# EAGLE design Relais2-N_Channel_MOSFET-V001 (EAGLE 9.5.1)
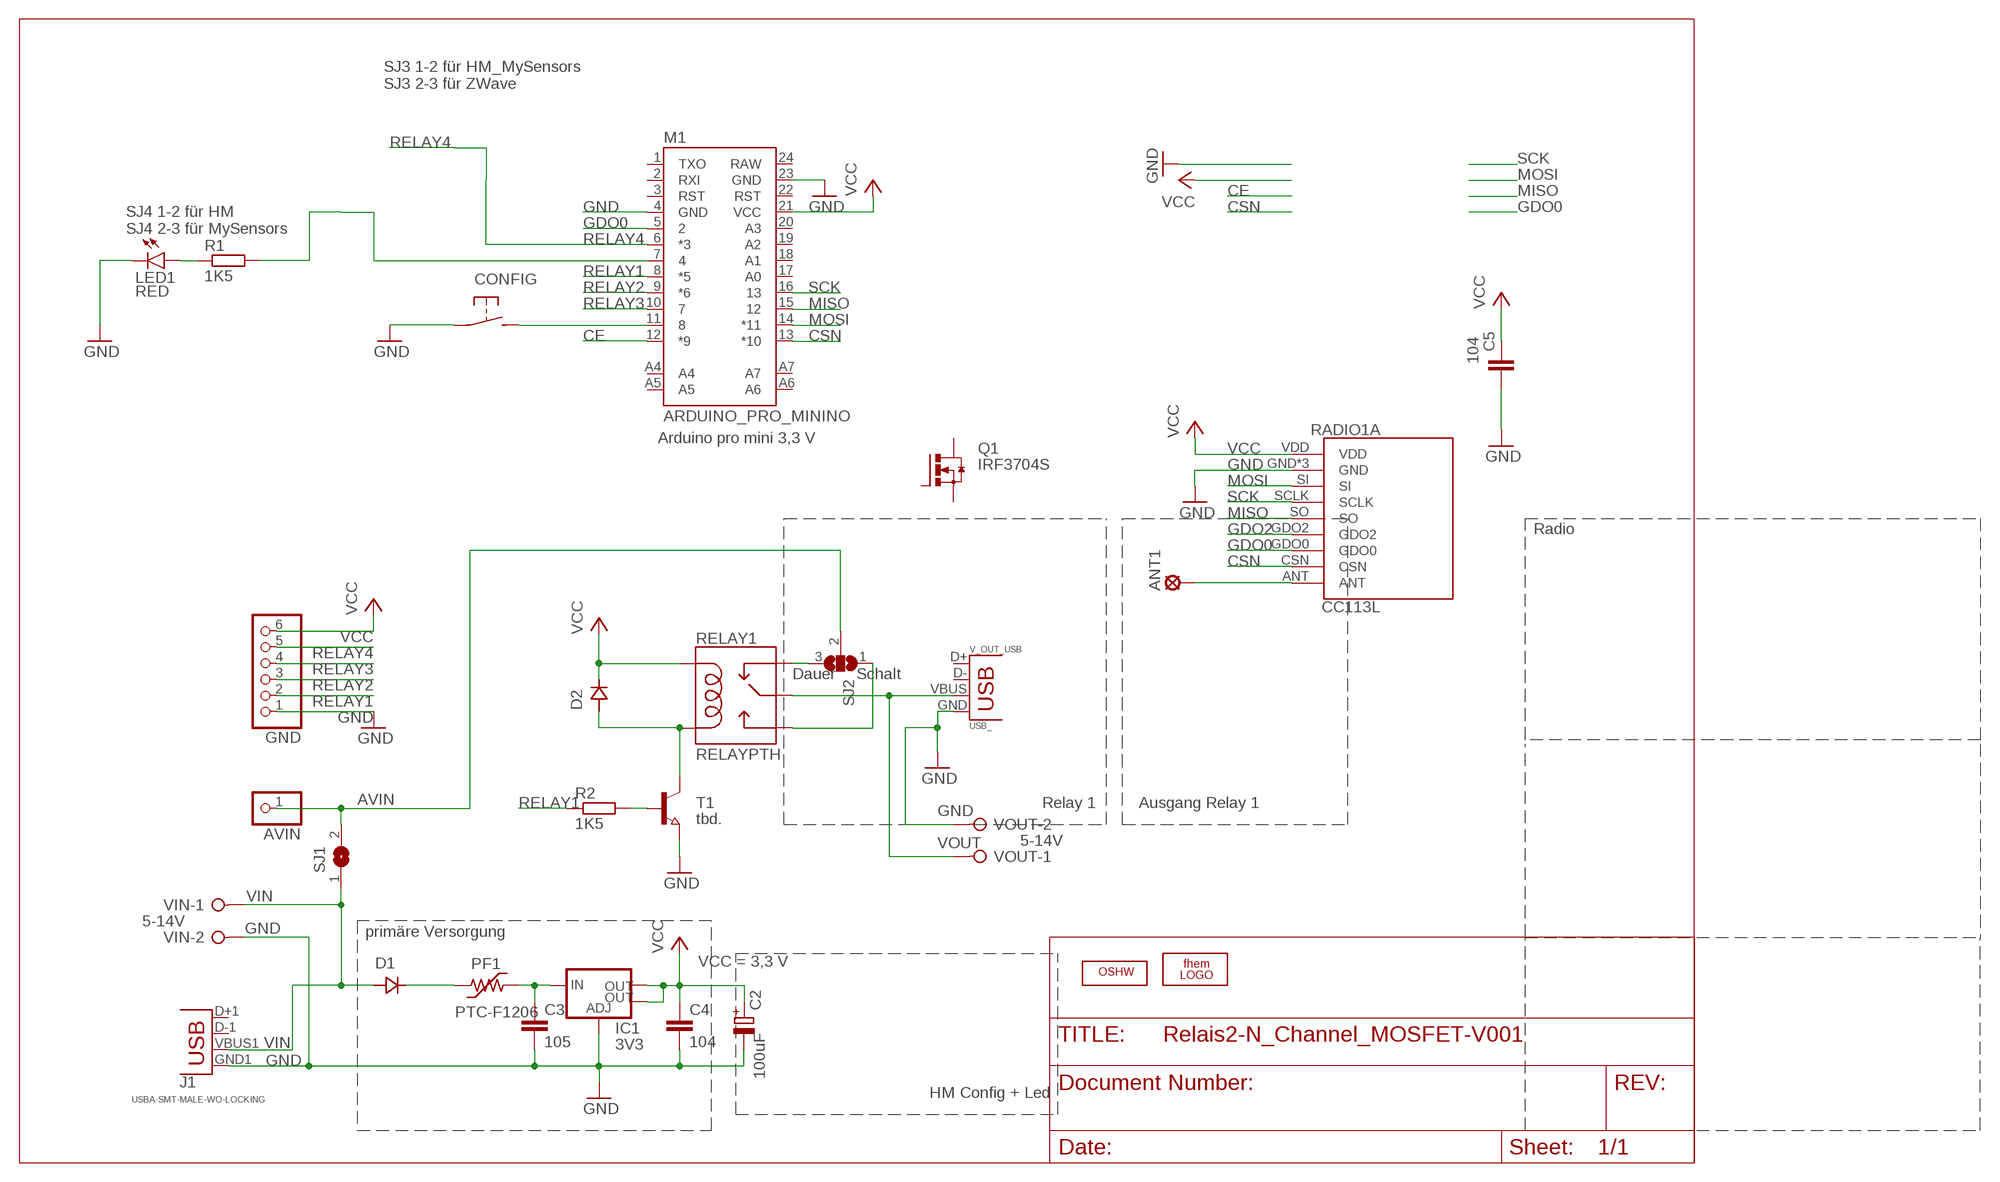
[diagram p0: schematic, sheet 1]

## Parts
ANT1  LSP10  [LSP10]
AVIN  PINHD-1X1  [1X01]
C2  100uF  CPOL-EUE2,5-6E  [E2,5-6E]
C3  105  C-EUC0805  [C0805]
C4  104  C-EUC0805  [C0805]
C5  104  C-EUC0805  [C0805]
CONFIG  TASTERSMD  [TASTER-SMD]
D1  SS14  [DO214]
D2  SS14  [DO214]
GND  PINHD-1X6_S  [1X06]
IC1  3V3  V_REG_LM1117SOT223  [SOT223]
J1  USBA-SMT-MALE-WO-LOCKING  [USB-A-SMT-MALE-NO_LOCKING]
LED1  RED  LED-RED1206  [LED-1206]
LOGO2  LOGO_OSHWX0070  [OSHW_6X70]
M1  ARDUINO_PRO_MININO  [ARDUINO_PRO_MINI_O]
PF1  PTC-F1206  [F1206]
Q1  IRF3704S  [D2PACK]
R1  1K5  R0805_SMALL_GAP  [R0805_SMALL_GAP]
R2  1K5  R0805_SMALL_GAP  [R0805_SMALL_GAP]
RADIO1A  CC113L  [CC113L]
RELAY1  RELAYPTH  [SRD-05VDC-SL-C]
SJ1  SJ  [SJ]
SJ2  SJ2W  [SJ_2]
T1  tbd.  NPN-TRANSISTOR_SOT89  [SOT89]
U$2  LOGO_FHEMSTOP  [LOGO_FHEM_3X3_STOP]
V_OUT_USB  USB_  [USB-A-S-SILK-FEMALE]
VIN  W237-02P  [W237-132]
VOUT  W237-02P  [W237-132]

## Nets
AVIN: AVIN.1 SJ1.2 SJ2.2
CE: M1.12(*9)
CSN: M1.13(*10) RADIO1A.CSN
DAUER: RELAY1.SWCLOSED(SWCLOSE) SJ2.3
GDO0: M1.5 RADIO1A.GDO0
GDO2: RADIO1A.GDO2
GND: C2.- C3.2 C4.2 C5.2 CONFIG.1(P) GND.1 IC1.1(ADJ) J1.GND1(GND) LED1.C M1.4(GND) M1.23(GND) RADIO1A.GND RADIO1A.GND1(GND) RADIO1A.GND2(GND) T1.3(E) V_OUT_USB.GND VIN.2 VOUT.2
LED: M1.7 R1.2
MISO: M1.15 RADIO1A.SO
MOSI: M1.14(*11) RADIO1A.SI
N$1: CONFIG.2(S) M1.11
N$3: LED1.A R1.1
N$11: ANT1.1(MP) RADIO1A.ANT
N$13: D2.ANODE RELAY1.COIL0 T1.2(C)
N$16: R2.2 T1.1(B)
RELAY1: GND.2 M1.8(*5) R2.1
RELAY2: GND.3 M1.9(*6)
RELAY3: GND.4 M1.10
RELAY4: GND.5 M1.6(*3)
SCHALT: RELAY1.SWOPEN SJ2.1
SCK: M1.16 RADIO1A.SCLK
VCC: C2.+ C4.1 C5.1 D2.CATHODE GND.6 IC1.2(OUT) IC1.4(OUT) M1.21(VCC) RADIO1A.VDD RELAY1.COIL1
VIN: D1.ANODE J1.VBUS1(VBUS) SJ1.1 VIN.1
VOUT: RELAY1.SWCOMMON V_OUT_USB.VBUS VOUT.1
VREG_IN: C3.1 IC1.3(IN) PF1.2
VUSB: D1.CATHODE PF1.1
Unconnected: J1.D+1(D+) J1.D-1(D-) M1.1(TXO) M1.2(RXI) M1.3(RST) M1.17(A0) M1.18(A1) M1.19(A2) M1.20(A3) M1.22(RST) M1.24(RAW) M1.A4 M1.A5 M1.A6 M1.A7 Q1.1(G) Q1.2(D) Q1.3(S) V_OUT_USB.D+ V_OUT_USB.D-

## Notes on the sheet
- SJ3 1-2 für HM_MySensors
  SJ3 2-3 für ZWave
- SJ4 1-2 für HM
  SJ4 2-3 für MySensors
- Arduino pro mini 3,3 V
- Radio
- Dauer | Schalt
- Relay 1 | Ausgang Relay 1
- 5-14V
- 5-14V
- primäre Versorgung
- VCC = 3,3 V
- HM Config + Led

## Library data of the parts
ANT1 = Hexenmeister:LSP10: SOLDER PAD drill 1.0 mm, distributor Buerklin, 12H555
AVIN = pinhead:PINHD-1X1: PIN HEADER
C2 = rcl:CPOL-EU: POLARIZED CAPACITOR, European symbol
C3-C5 = resistor:C-EU: CAPACITOR, European symbol
CONFIG = Damian:TASTER: Microtaster
D1 D2 = ihpcb-diode:SS14
GND = Hexenmeister:PINHD-1X6_S: PIN HEADER
IC1 = SparkFun-PowerIC:V_REG_LM1117: Voltage Regulator LM1117 Standard adjustable voltage regulator but in SMD form. Spark Fun Electronics SKU : COM-00595; PROD_ID: VREG-08170
J1 V_OUT_USB = SparkFun-Connectors:USB: USB Connectors USB-B-PTH is fully proven SKU : PRT-00139/CONN-08278 USB-miniB is fully proven SKU : PRT-00587 USB-A-PCB is untested. USB-A-H is throughly reviewed, but untested. Spark Fun Electronics SKU : PRT-00437 USB-B-SMT is throughly reviewed, but untested. Needs silkscreen touching up. USB-A-S has not been used/tested USB-MB-H has not been used/tested USB-MICROB has been used. CONN-09505
LED1 = SparkFun-LED:LED-RED: Assorted Red LEDs LilyPad 1206- DIO-09912 1206- DIO-00809 0603- DIO-00819 "SMART" means more efficient and expensive; PROD_ID: DIO-09912
LOGO2 = mechanics:LOGO_OSHW: Open-Source-Hardware Logo
M1 = Hexenmeister:ARDUINO_PRO_MINI
PF1 = polyswitch:PTC-: POLYSWITCH Polyswitch Resetable Fuses
Q1 = transistor-power:IRF3704: SMPS MOSFET HEXFET® Power MOSFET Source: http://www.irf.com/product-info/datasheets/data/irf3704.pdf
R1 R2 = Hexenmeister:R0805_SMALL_GAP: SMD Resistor (0805) mit einer schmalleren Lücke (kann als Lötjumper erwendet werden)
RADIO1A = Damian:CC113L: CC113L Value Line Receiver Module CC1101 replacement module Source: http://www.ti.com/product/cc113l
RELAY1 = SRD-05VDC-SL-C:RELAY: SPDT relay (COM-00101)
SJ1 = jumper:SJ: SMD solder JUMPER
SJ2 = jumper:SJ2W: SMD solder JUMPER
T1 = semicon-smd-ipc:NPN-TRANSISTOR_: NPN TRANSISTOR
U$2 = logo:LOGO_FHEM: fhem logo for PCB
VIN VOUT = Hexenmeister:W237-02P: WAGO SREW CLAMP; OC_FARNELL: unknown; OC_NEWARK: unknown

## Board
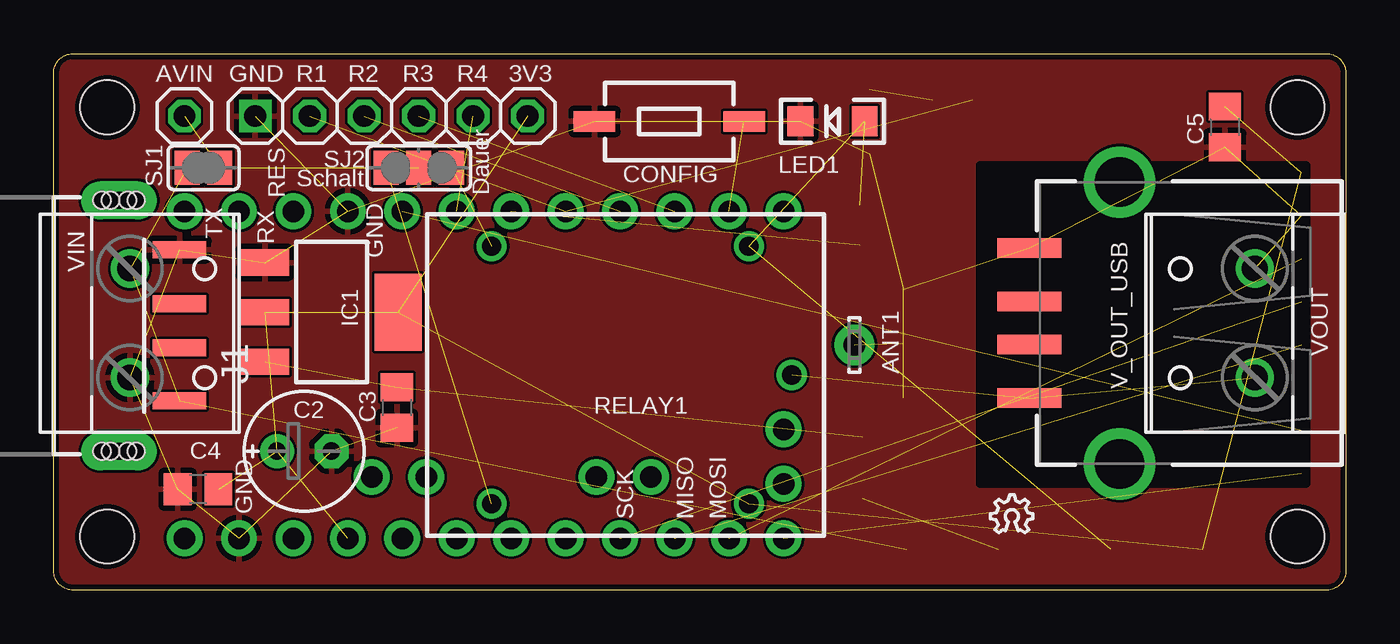
[diagram p1: board, top side]
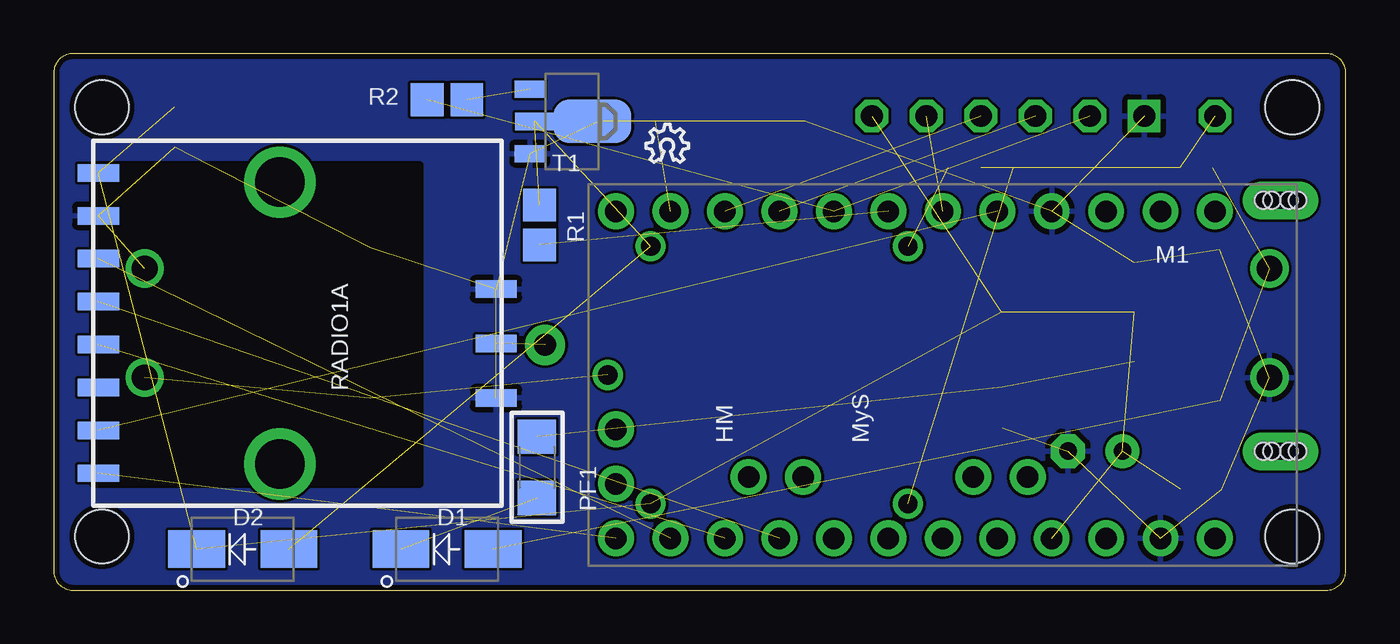
[diagram p2: board, bottom side, seen from below]

Size 60.26 x 25.01 mm. Coordinates in mm from the lower left corner, seen from the top.
Outline: 0.01,0.81 0.01,24.01 arc-90 0.81,25.01 59.26,25.01 arc-90 60.26,24.21 60.26,1.01 arc-90 59.46,0.01 1.01,0.01 arc-90 0.01,0.81
Copper layers (1*16): Top 0.035mm / dielectric 1.5mm / Bottom 0.035mm
Design rules "dirtypcbs_v1.0": minimum track width 5mil, minimum drill 12mil, track to track 5mil, track to pad 5mil, pad to pad 5mil, via to via 5mil, smd to smd 0mil, copper to edge 10mil, drill to drill 10mil, minimum pad ring 10mil, minimum via ring 6mil, stop-mask expansion 2mil, vias tented up to drill 25mil, thermal gap 10mil
Holes 2.5 mm at 2.51,2.51 58.01,2.51 58.01,22.51 2.51,22.51

### Footprints (pad centres in the part's own frame; a part is rotated, then mirrored left to right if it is on the bottom)
LSP10 = drill 1.016 pad 1.88: 1 0,0
1X01 = drill 1.016 octagon: 1 0,0
E2,5-6E = drill 0.813 pad 1.575: + -1.27,0 | drill 0.813 pad 1.575 octagon: - 1.27,0
C0805 = smd 1.3 x 1.5: 1 -0.95,0; 2 0.95,0
TASTER-SMD = smd 1.93 x 0.965: 1 -3.493,0; 2 3.493,0
DO214 = smd 2.65 x 1.75: ANODE -2.15,0; CATHODE 2.15,0
1X06 = drill 1.016 square: 1 -6.35,0 | drill 1.016 octagon: 2 -3.81,0; 3 -1.27,0; 4 1.27,0; 5 3.81,0; 6 6.35,0
SOT223 = smd 1.219 x 2.235: 1 -2.311,-3.099; 2 0,-3.099; 3 2.311,-3.099 | smd 3.6 x 2.2: 4 0,3.099
USB-A-SMT-MALE-NO_LOCKING = smd 0.8 x 2.5: D+1 1.027,-5.87; D-1 -1.027,-5.87; GND1 3.551,-5.87; VBUS1 -3.5,-5.87 | drill 0.8 pad 1.778 long: P$1 5.85,-3.05; P$3 -5.85,-3.05 | hole 0.8: -5.85,-3.45; -5.85,-3.85; -5.85,-2.65; -5.85,-2.25; 5.85,-3.45; 5.85,-3.85; 5.85,-2.65; 5.85,-2.25
LED-1206 = smd 1.2 x 1.4: A -1.5,0; C 1.5,0
ARDUINO_PRO_MINI_O = drill 1 pad 1.676: 1 -7.62,12.7; 2 -7.62,10.16; 3 -7.62,7.62; 4 -7.62,5.08; 5 -7.62,2.54; 6 -7.62,0; 7 -7.62,-2.54; 8 -7.62,-5.08; 9 -7.62,-7.62; 10 -7.62,-10.16; 11 -7.62,-12.7; 12 -7.62,-15.24; 13 7.62,-15.24; 14 7.62,-12.7; 15 7.62,-10.16; 16 7.62,-7.62; 17 7.62,-5.08; 18 7.62,-2.54; 19 7.62,0; 20 7.62,2.54; 21 7.62,5.08; 22 7.62,7.62; 23 7.62,10.16; 24 7.62,12.7; A4 4.763,1.429; A5 4.763,3.969; A6 4.763,-9.049; A6@1 2.54,-15.24; A7 4.763,-6.509; A7@1 5.08,-15.24
F1206 = smd 1.6 x 1.803: 1 -1.429,0; 2 1.429,0
D2PACK = smd 2.083 x 3.81: 1 -2.54,-8.89; 3 2.54,-8.89 | smd 11.43 x 8.89: 2 0,2.54
R0805_SMALL_GAP = smd 1.524 x 1.524: 1 -0.927,0; 2 0.927,0
CC113L = smd 0.813 x 1.93: ANT 0.953,9.271; CSN 7,-9.271; GDO0 5,-9.271; GDO2 3,-9.271; GND -5,-9.271; GND1 -1.587,9.271; GND2 3.493,9.271; SCLK -1,-9.271; SI -3,-9.271; SO 1,-9.271; VDD -7,-9.271
SRD-05VDC-SL-C = drill 0.9: COIL0 -5.39,-6.12; COIL1 -5.39,5.88; SWCLOSED 6.61,-6.12; SWCOMMON -7.39,-0.12; SWOPEN 6.61,5.88
SJ = smd 1.168 x 1.6: 1 -0.762,0; 2 0.762,0
SJ_2 = smd 1.168 x 1.6: 1 -1.524,0; 2 0,0; 3 1.524,0
SOT89 = smd 0.8 x 1.4: 1 -1.499,-1.981; 3 1.499,-1.981 | smd 0.8 x 1.9: 2 0,-1.727 | smd 2.032 x 3.65: 2@1 0,0.94
USB-A-S-SILK-FEMALE = smd 3 x 0.9: D+ 7.212,-1; D- 7.212,1; GND 7.212,-3.5; VBUS 7.212,3.5 | drill 2.311: P$5 3,-6.566; P$6 3,6.566
W237-132 = drill 1.194: 1 -2.54,-0.635; 2 2.54,-0.635

### Placement (x,y rotation side)
ANT1  37.34,11.44 90 top
AVIN  6.1,22.1 0 top
C2  11.69,6.48 0 top
C3  16.01,8.51 270 top
C4  6.74,4.7 180 top
C5  54.62,21.6 270 top
CONFIG  28.71,21.85 0 top
D1  41.92,1.91 180 bottom
D2  51.44,1.91 180 bottom
GND  15.75,22.1 0 top
IC1  12.96,12.96 270 top
J1  0.01,12.32 90 top
LED1  36.33,21.85 180 top
LOGO1  LOGO_OSHWX0070  [OSHW_6X70]  43.69,2.67 0 top
LOGO2  32.64,19.94 0 bottom
M1  18.8,10.04 270 bottom
PF1  37.72,5.72 90 bottom
Q1  -20.95,10.8 0 top  (outside the outline)
R1  37.6,17.02 270 bottom
R2  41.92,22.87 0 bottom
RADIO1A  48.9,12.45 270 bottom
RELAY1  27.03,9.91 180 top
SJ1  6.99,19.69 0 top
SJ2  17.02,19.69 0 top
T1  36.07,21.85 270 bottom
U$2  36.84,17.79 0 top
V_OUT_USB  52.71,12.45 180 top
VIN  4.2,12.45 270 top
VOUT  55.38,12.45 90 top

### Tracks (layer width: path | path; a pad name or v marks a point on that pad's centre or on a via)
AVIN  (2 unrouted)
CSN  (1 unrouted)
DAUER  (1 unrouted)
GDO0  (1 unrouted)
GND  (17 unrouted)
  pour Bottom: 0.01,0.01 0.01,25.02 60.33,25.02 60.33,0.01
  pour Top: 0.01,0.01 0.01,25.02 60.33,25.02 60.33,0.01
  cutout Top: 58.43,19.82 43.19,19.82 43.19,4.96 58.43,4.96
  cutout Bottom: 58.43,19.82 43.19,19.82 43.19,4.96 58.43,4.96
LED  (1 unrouted)
MISO  (1 unrouted)
MOSI  (1 unrouted)
N$1  (1 unrouted)
N$3  (1 unrouted)
N$11  (1 unrouted)
N$13  (2 unrouted)
N$16  (1 unrouted)
RELAY1  (2 unrouted)
RELAY2  (1 unrouted)
RELAY3  (1 unrouted)
RELAY4  (1 unrouted)
SCHALT  (1 unrouted)
SCK  (1 unrouted)
VCC  (9 unrouted)
VIN  (3 unrouted)
VOUT  (2 unrouted)
VREG_IN  (2 unrouted)
VUSB  (1 unrouted)

### Text on the board
tNames: R1 | R2 | R3 | R4 | 3V3 | Schalt | RES | Dauer | TX | RX | GND | GND | SCK | MISO | MOSI
bNames: MyS | HM
tStop: HM-MYS-RELAY v1.1
bStop: HM-MYS-RELAY v1.1